# Altium schematic sheet Cube_Controller.SchDoc
size A3; DrawnBy: Tobias Wulf
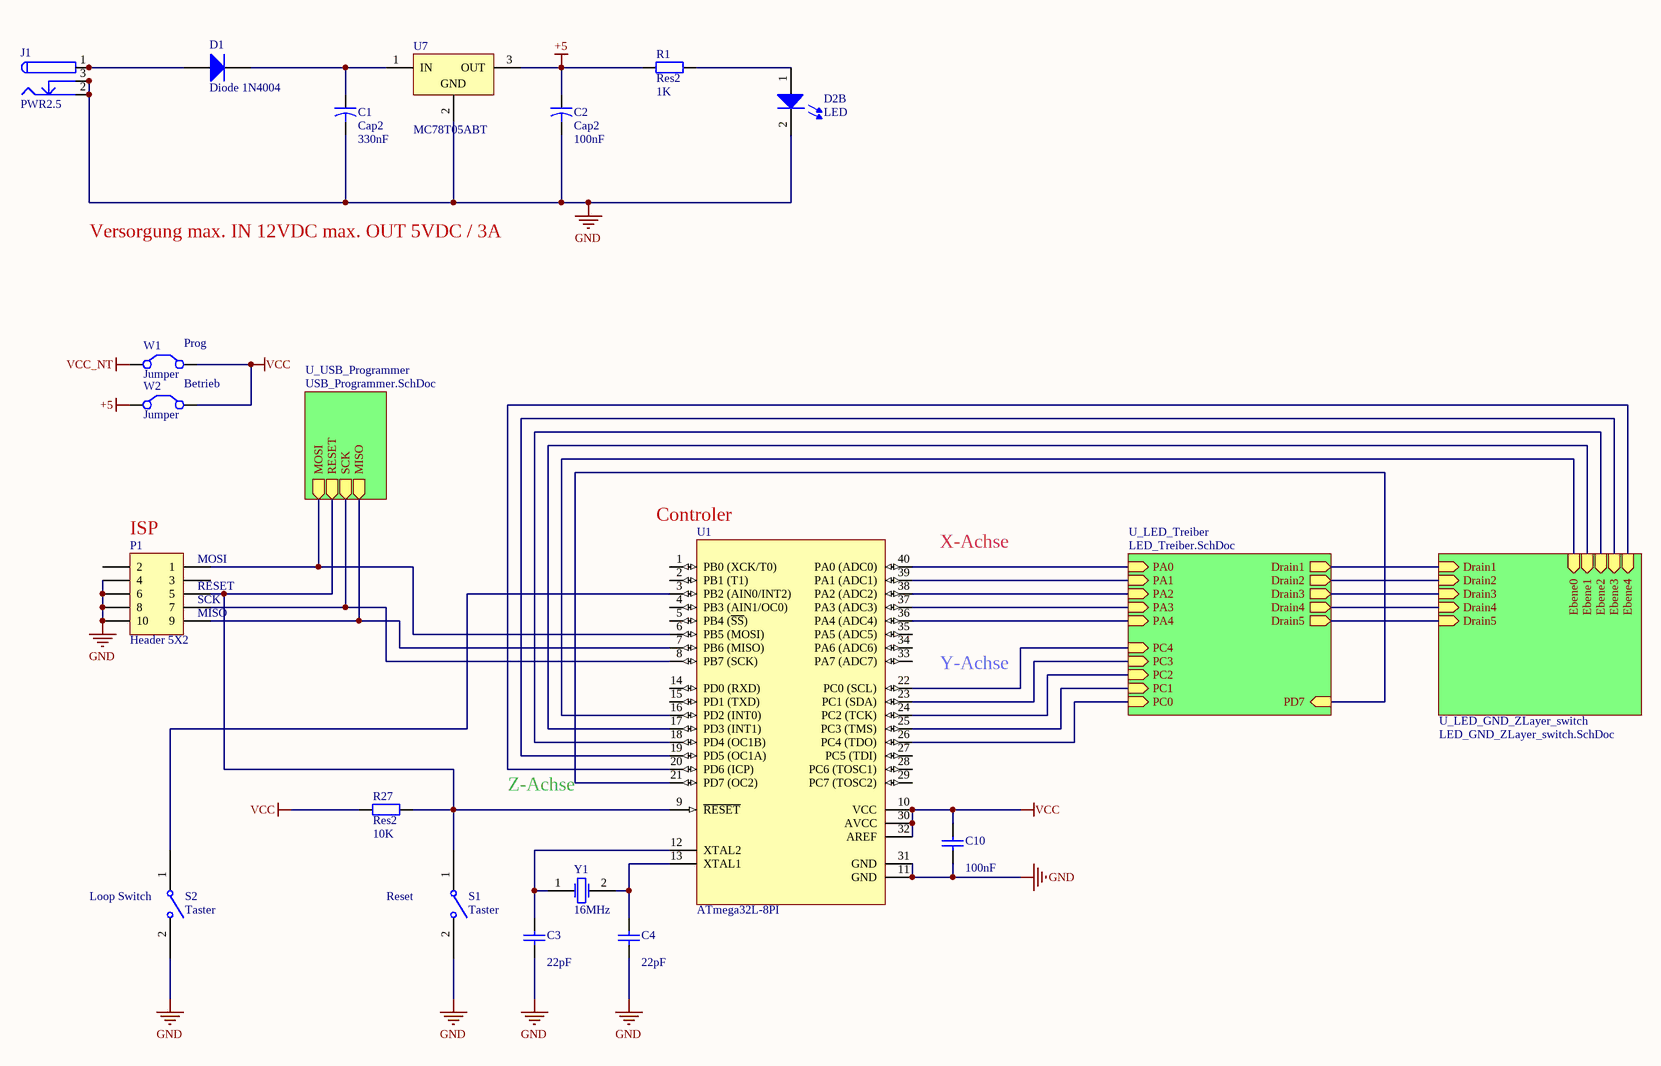
[diagram p0: Cube_Controller.SchDoc]

## Parts
C1  Cap2  value 330nF  [RAD-0.1]
C2  Cap2  value 100nF  [RAD-0.1]
C3  value 22pF  [RAD-0.1]  (hidden comment: Cap Semi)
C4  value 22pF  [RAD-0.1]  (hidden comment: Cap Semi)
C10  value 100nF  [RAD-0.1]  (hidden comment: Cap)
D1  Diode 1N4004  [DO-41]
D2  LED  [LED 3mm]  (part B of 2)
J1  PWR2.5  [KLD-0202]
P1  Header 5X2  [HDR2X5]
R1  Res2  value 1K  [AXIAL-0.4]
R27  Res2  value 10K  [AXIAL-0.4]
S1  Taster  [Taster]
S2  Taster  [Taster]
U1  ATmega32L-8PI  [40P6]
U7  MC78T05ABT  [221A-04]
W1  Jumper  [HDR1X2]
W2  Jumper  [HDR1X2]
Y1  16MHz  [Quarz HC49-4HL]

## Sub-sheets
U_LED_GND_ZLayer_switch = LED_GND_ZLayer_switch.SchDoc: Ebene0 (in), Ebene1 (in), Ebene2 (in), Ebene3 (in), Ebene4 (in), Drain1 (in), Drain2 (in), Drain3 (in), Drain4 (in), Drain5 (in)
U_LED_Treiber = LED_Treiber.SchDoc: PA0 (in), PA1 (in), PA2 (in), PA3 (in), PA4 (in), PC0 (in), PD7 (in), PC1 (in), PC2 (in), PC3 (in), PC4 (in), Drain1 (out), Drain2 (out), Drain3 (out), Drain4 (out), Drain5 (out)
U_USB_Programmer = USB_Programmer.SchDoc: MOSI (out), RESET (out), SCK (out), MISO (out)

## Nets
+5: C2.1 R1.1 U7.3(OUT) W2.1(C1)
GND: C1.2 C2.2 C3.1 C4.1 C10.1 D2.2 J1.2 J1.2A J1.2B J1.3 J1.3A J1.3B P1.4 P1.6 P1.8 P1.10 S1.2 S2.2 U1.11(GND) U1.31(GND) U7.2(GND)
VCC: C10.2 R27.1 U1.10(VCC) U1.30(AVCC) U1.32(AREF) W1.2(C2) W2.2(C2)
VCC_NT: W1.1(C1)
NetC1_1: C1.1 D1.2(K) U7.1(IN)
NetC3_2: C3.2 U1.12(XTAL2) Y1.1
NetC4_2: C4.2 U1.13(XTAL1) Y1.2
NetD1_1: D1.1(A) J1.1 J1.1A J1.1B
NetD2_1: D2.1 R1.2
NetP1_1: P1.1 U1.6(PB5_(MOSI)) ; sheet U_USB_Programmer/MOSI
NetP1_5: P1.5 R27.2 S1.1 U1.9(~{RESET}) ; sheet U_USB_Programmer/RESET
NetP1_7: P1.7 U1.8(PB7_(SCK)) ; sheet U_USB_Programmer/SCK
NetP1_9: P1.9 U1.7(PB6_(MISO)) ; sheet U_USB_Programmer/MISO
NetS2_1: S2.1 U1.3(PB2_(AIN0/INT2))
NetU1_16: U1.16(PD2_(INT0)) ; sheet U_LED_GND_ZLayer_switch/Ebene0
NetU1_17: U1.17(PD3_(INT1)) ; sheet U_LED_GND_ZLayer_switch/Ebene1
NetU1_18: U1.18(PD4_(OC1B)) ; sheet U_LED_GND_ZLayer_switch/Ebene2
NetU1_19: U1.19(PD5_(OC1A)) ; sheet U_LED_GND_ZLayer_switch/Ebene3
NetU1_20: U1.20(PD6_(ICP)) ; sheet U_LED_GND_ZLayer_switch/Ebene4
NetU1_21: U1.21(PD7_(OC2)) ; sheet U_LED_Treiber/PD7
NetU1_22: U1.22(PC0_(SCL)) ; sheet U_LED_Treiber/PC4
NetU1_23: U1.23(PC1_(SDA)) ; sheet U_LED_Treiber/PC3
NetU1_24: U1.24(PC2_(TCK)) ; sheet U_LED_Treiber/PC2
NetU1_25: U1.25(PC3_(TMS)) ; sheet U_LED_Treiber/PC1
NetU1_26: U1.26(PC4_(TDO)) ; sheet U_LED_Treiber/PC0
NetU1_36: U1.36(PA4_(ADC4)) ; sheet U_LED_Treiber/PA4
NetU1_37: U1.37(PA3_(ADC3)) ; sheet U_LED_Treiber/PA3
NetU1_38: U1.38(PA2_(ADC2)) ; sheet U_LED_Treiber/PA2
NetU1_39: U1.39(PA1_(ADC1)) ; sheet U_LED_Treiber/PA1
NetU1_40: U1.40(PA0_(ADC0)) ; sheet U_LED_Treiber/PA0
(unnamed): sheet U_LED_Treiber/Drain1, sheet U_LED_GND_ZLayer_switch/Drain1
(unnamed): sheet U_LED_Treiber/Drain2, sheet U_LED_GND_ZLayer_switch/Drain2
(unnamed): sheet U_LED_Treiber/Drain3, sheet U_LED_GND_ZLayer_switch/Drain3
(unnamed): sheet U_LED_Treiber/Drain4, sheet U_LED_GND_ZLayer_switch/Drain4
(unnamed): sheet U_LED_Treiber/Drain5, sheet U_LED_GND_ZLayer_switch/Drain5

Not connected (* = marked no-connect by the designer): P1 2 3; U1 1(PB0_(XCK/T0)) 2(PB1_(T1)) 4(PB3_(AIN1/OC0)) 5(PB4_(~{SS})) 14(PD0_(RXD)) 15(PD1_(TXD)) 27(PC5_(TDI)) 28(PC6_(TOSC1)) 29(PC7_(TOSC2)) 33(PA7_(ADC7)) 34(PA6_(ADC6)) 35(PA5_(ADC5))

## Notes on the sheet
- Versorgung max. IN 12VDC max. OUT 5VDC / 3A
- (near W1) Prog
- Betrieb
- (near U1) Controler
- (near P1) ISP
- (near P1) RESET
- (near P1) MOSI
- X-Achse
- (near P1) MISO
- (near P1) SCK
- Y-Achse
- Z-Achse
- (near S2) Loop Switch
- (near S1) Reset

## Library data of the parts
C1 C2 = Cap2: Capacitor; Published: 23-Sep-2002; PackageReference: CAPR5-4X5; Publisher: Altium Limited; PackageDescription: Capacitor; 2 Leads
C3 C4 = Cap Semi: Capacitor (Semiconductor SIM Model); Published: 8-Jun-2000; LatestRevisionDate: 29-May-2009; LatestRevisionNote: IPC-7351 Footprint Added.; PackageReference: C1206; Publisher: Altium Limited; PackageDescription: Chip Capacitor
C10 = Cap: Capacitor; Published: 8-Jun-2000; LatestRevisionDate: 17-Jul-2002; LatestRevisionNote: Re-released for DXP Platform.; PackageReference: RAD-0.3; Publisher: Altium Limited; PackageDescription: Radial Cap, Thru-Hole; 2 Leads; 0.3 in Pin Spacing
D1 = Diode 1N4004: 1 Amp General Purpose Rectifier; Published: 8-Jun-2000; LatestRevisionDate: 17-Jul-2002; LatestRevisionNote: Re-released for DXP Platform.; DatasheetVersion: 1998; PackageVersion: Aug-1999; PackageReference: DO-41; Publisher: Altium Limited; PackageDescription: Diode, Axial; Body 5.2 x 2.7 mm (LxDia. max), Lead Dia. 0.86 mm (max); Code_JEDEC: DO-204-AL; ComponentLink1Description: Manufacturer Link; ComponentLink1URL: http://www.fairchildsemi.com/; ComponentLink2Description: Datasheet; ComponentLink2URL: http://www.fairchildsemi.com/ds/1N%2F1N4001.pdf
D2 = LED Std: LED bedrahtet
J1 = PWR2.5: Low Voltage Power Supply Connector; Published: 17-Dec-2003; DatasheetDocument: 09-May-2002; Publisher: Altium Limited; ComponentLink1Description: Manufacturer Link; ComponentLink1URL: http://domino.kycon.com/internet/Products.html
P1 = Header 5X2: Header, 5-Pin, Dual row; LatestRevisionDate: 17-Jul-2002; LatestRevisionNote: Re-released for DXP Platform.; Publisher: Altium Limited
R1 R27 = Res2: Resistor; Published: 8-Jun-2000; LatestRevisionDate: 17-Jul-2002; LatestRevisionNote: Re-released for DXP Platform.; PackageReference: AXIAL-0.4; Publisher: Altium Limited; PackageDescription: Axial Device, Thru-Hole; 2 Leads; 0.4 in Pin Spacing
U1 = ATmega32L-8PI: 8-Bit AVR Microcontroller with 32K Bytes of In-System Programmable Flash Memory; Published: 17-Sep-2003; LatestRevisionDate: 04-Mar-2005; LatestRevisionNote: Stylized 3D Model Added.; DatasheetVersion: 2503C-AVR-10/02; PackageVersion: Dec-1999; PackageReference: 40P6; Publisher: Altium Limited; PackageDescription: DIP; 40 Leads; Row Spacing 15.24 mm; Pitch 2.54 mm; ComponentLink1Description: Manufacturer Link; ComponentLink1URL: http://www.atmel.com; ComponentLink2Description: Datasheet; ComponentLink2URL: http://www.atmel.com/dyn/resources/prod_documents/doc2503.pdf
U7 = MC78T05ABT: Three-Ampere Positive Fixed Voltage Regulator; Note: Pin 2 is electrically connected to TAB; Published: 17-Jul-2002; DatasheetVersion: 1988; PackageReference: 221A-04; Publisher: Altium Limited; PackageDescription: TO, Thru-Hole, Vertical, Heatsink Mounted; 3 In-Line Leads; Pitch 2.54 mm; ComponentLink1Description: Manufacturer Link; ComponentLink1URL: http://www.onsemi.com/site/products/taxonomy/0,4438,503,00.html; ComponentLink2Description: Datasheet; ComponentLink2URL: http://www.onsemi.com/pub/Collateral/MC78T00-D.PDF; Code_JEDEC: TO-262-AA
W1 W2 = Jumper: Jumper Wire; Published: 24-Mar-1999; LatestRevisionDate: 17-Jul-2002; LatestRevisionNote: Re-released for DXP Platform.; PackageReference: RAD-0.2; Publisher: Altium Limited; PackageDescription: Radial Cap, Thru-Hole; 2 Leads; 0.2 in Pin Spacing
Y1 = Quarz HC49-4HL